# EAGLE schematic OLM-base-v.REV-I-SMT (EAGLE 6.4)
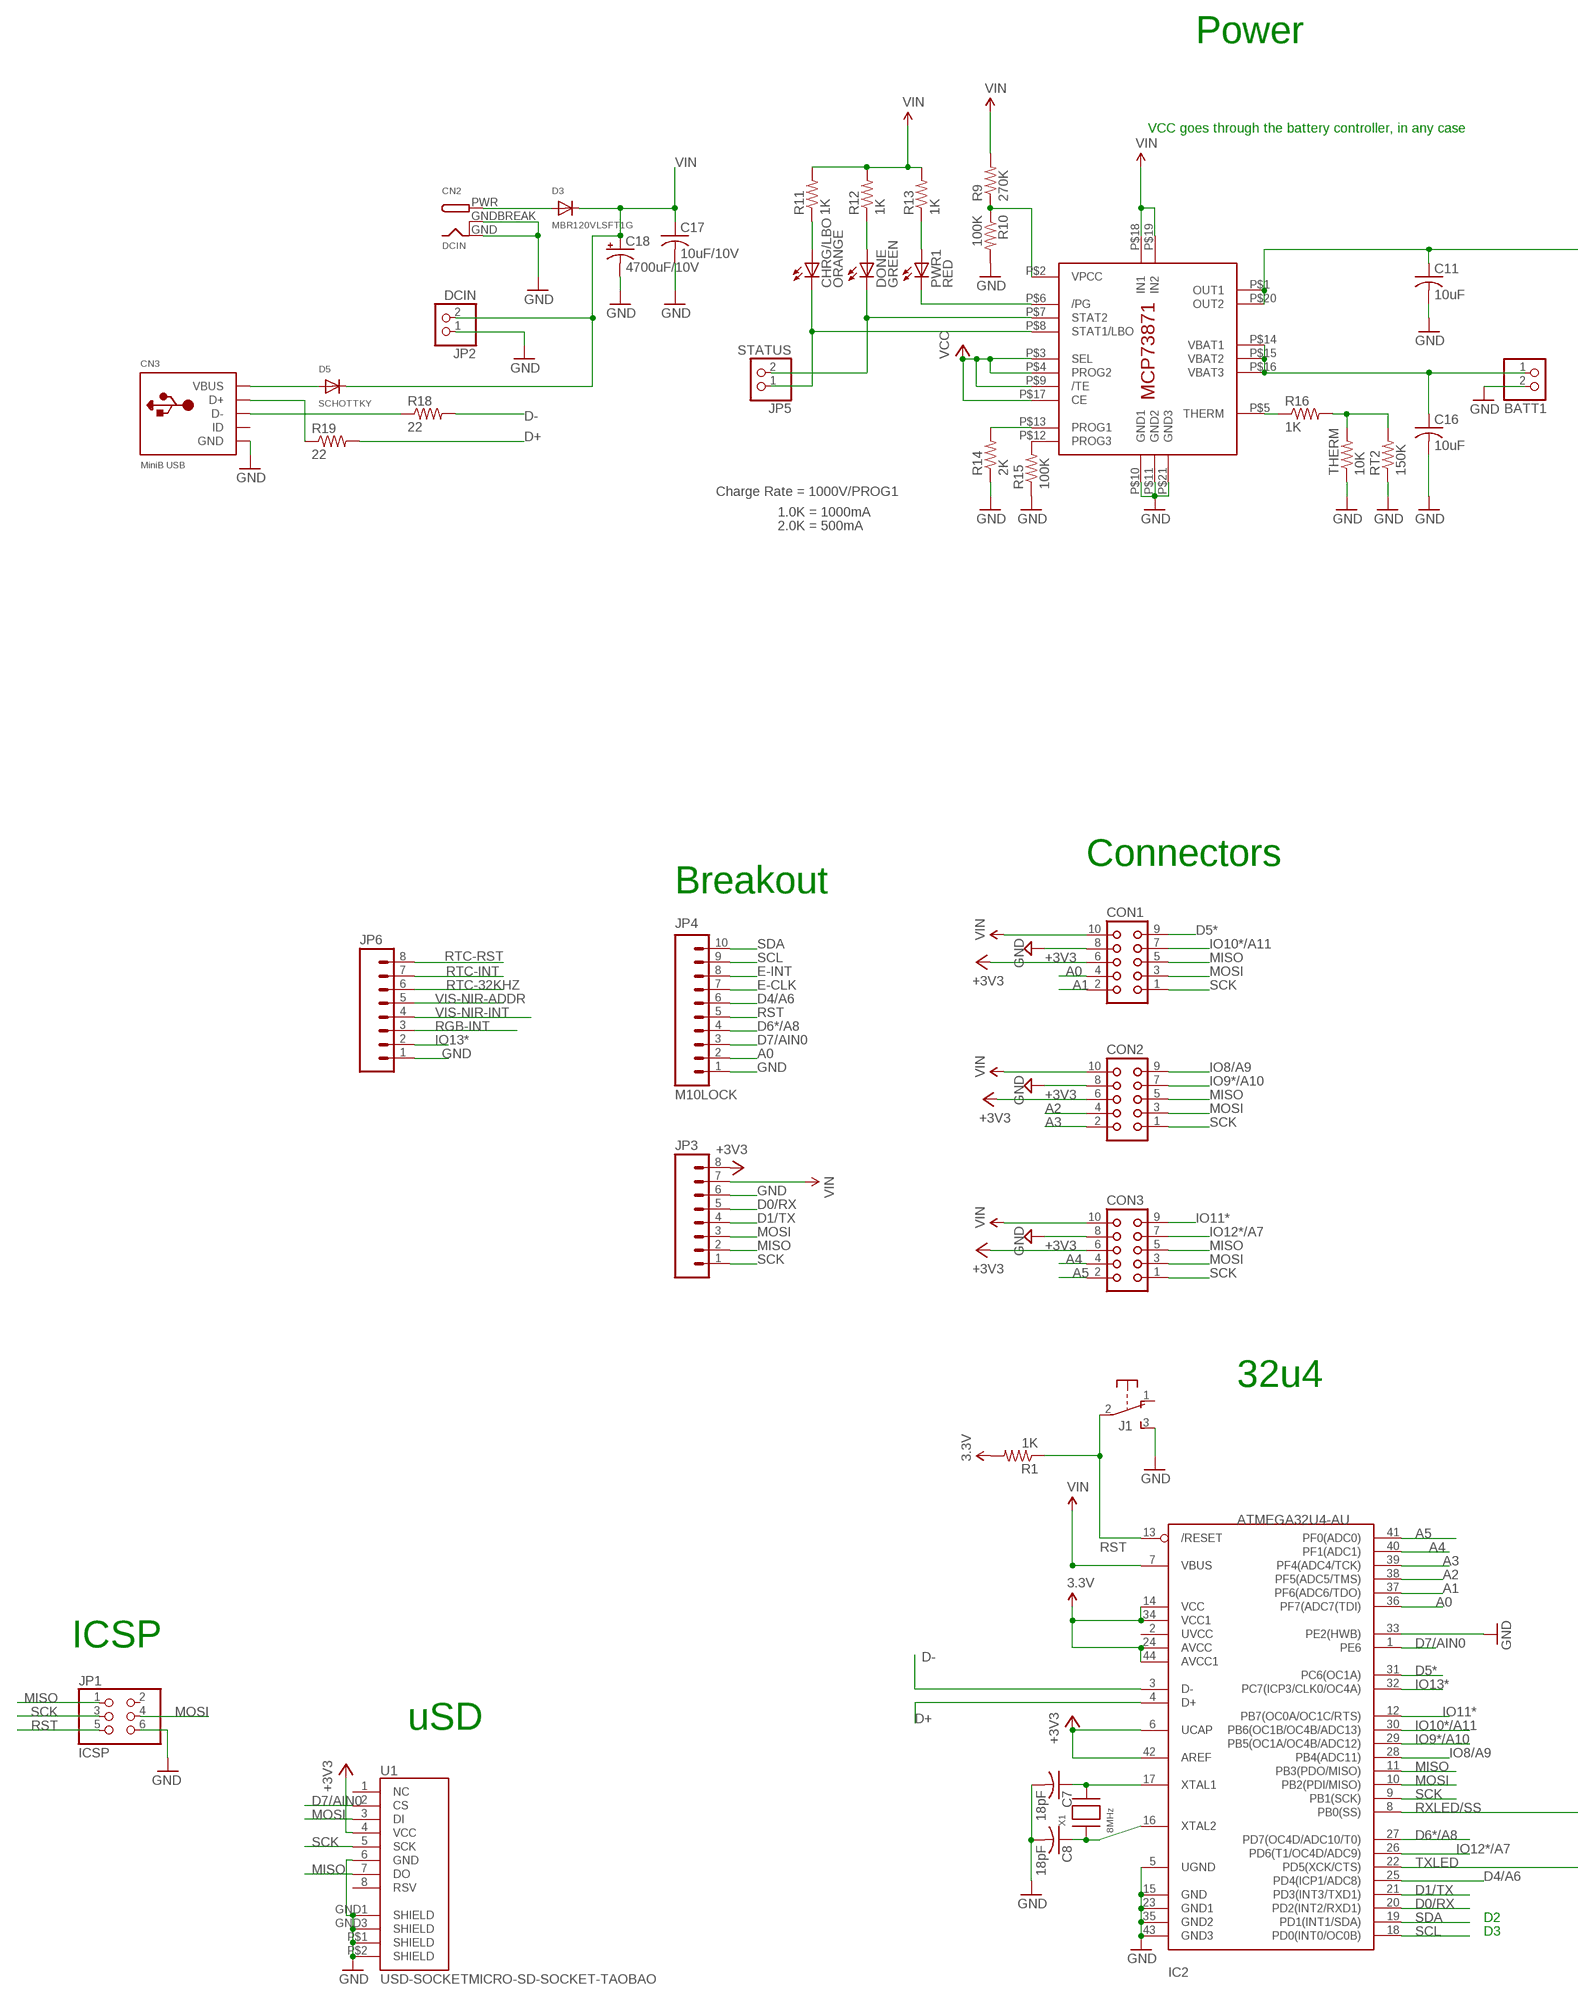
[diagram p0: schematic, sheet 1, part 1 of 3]
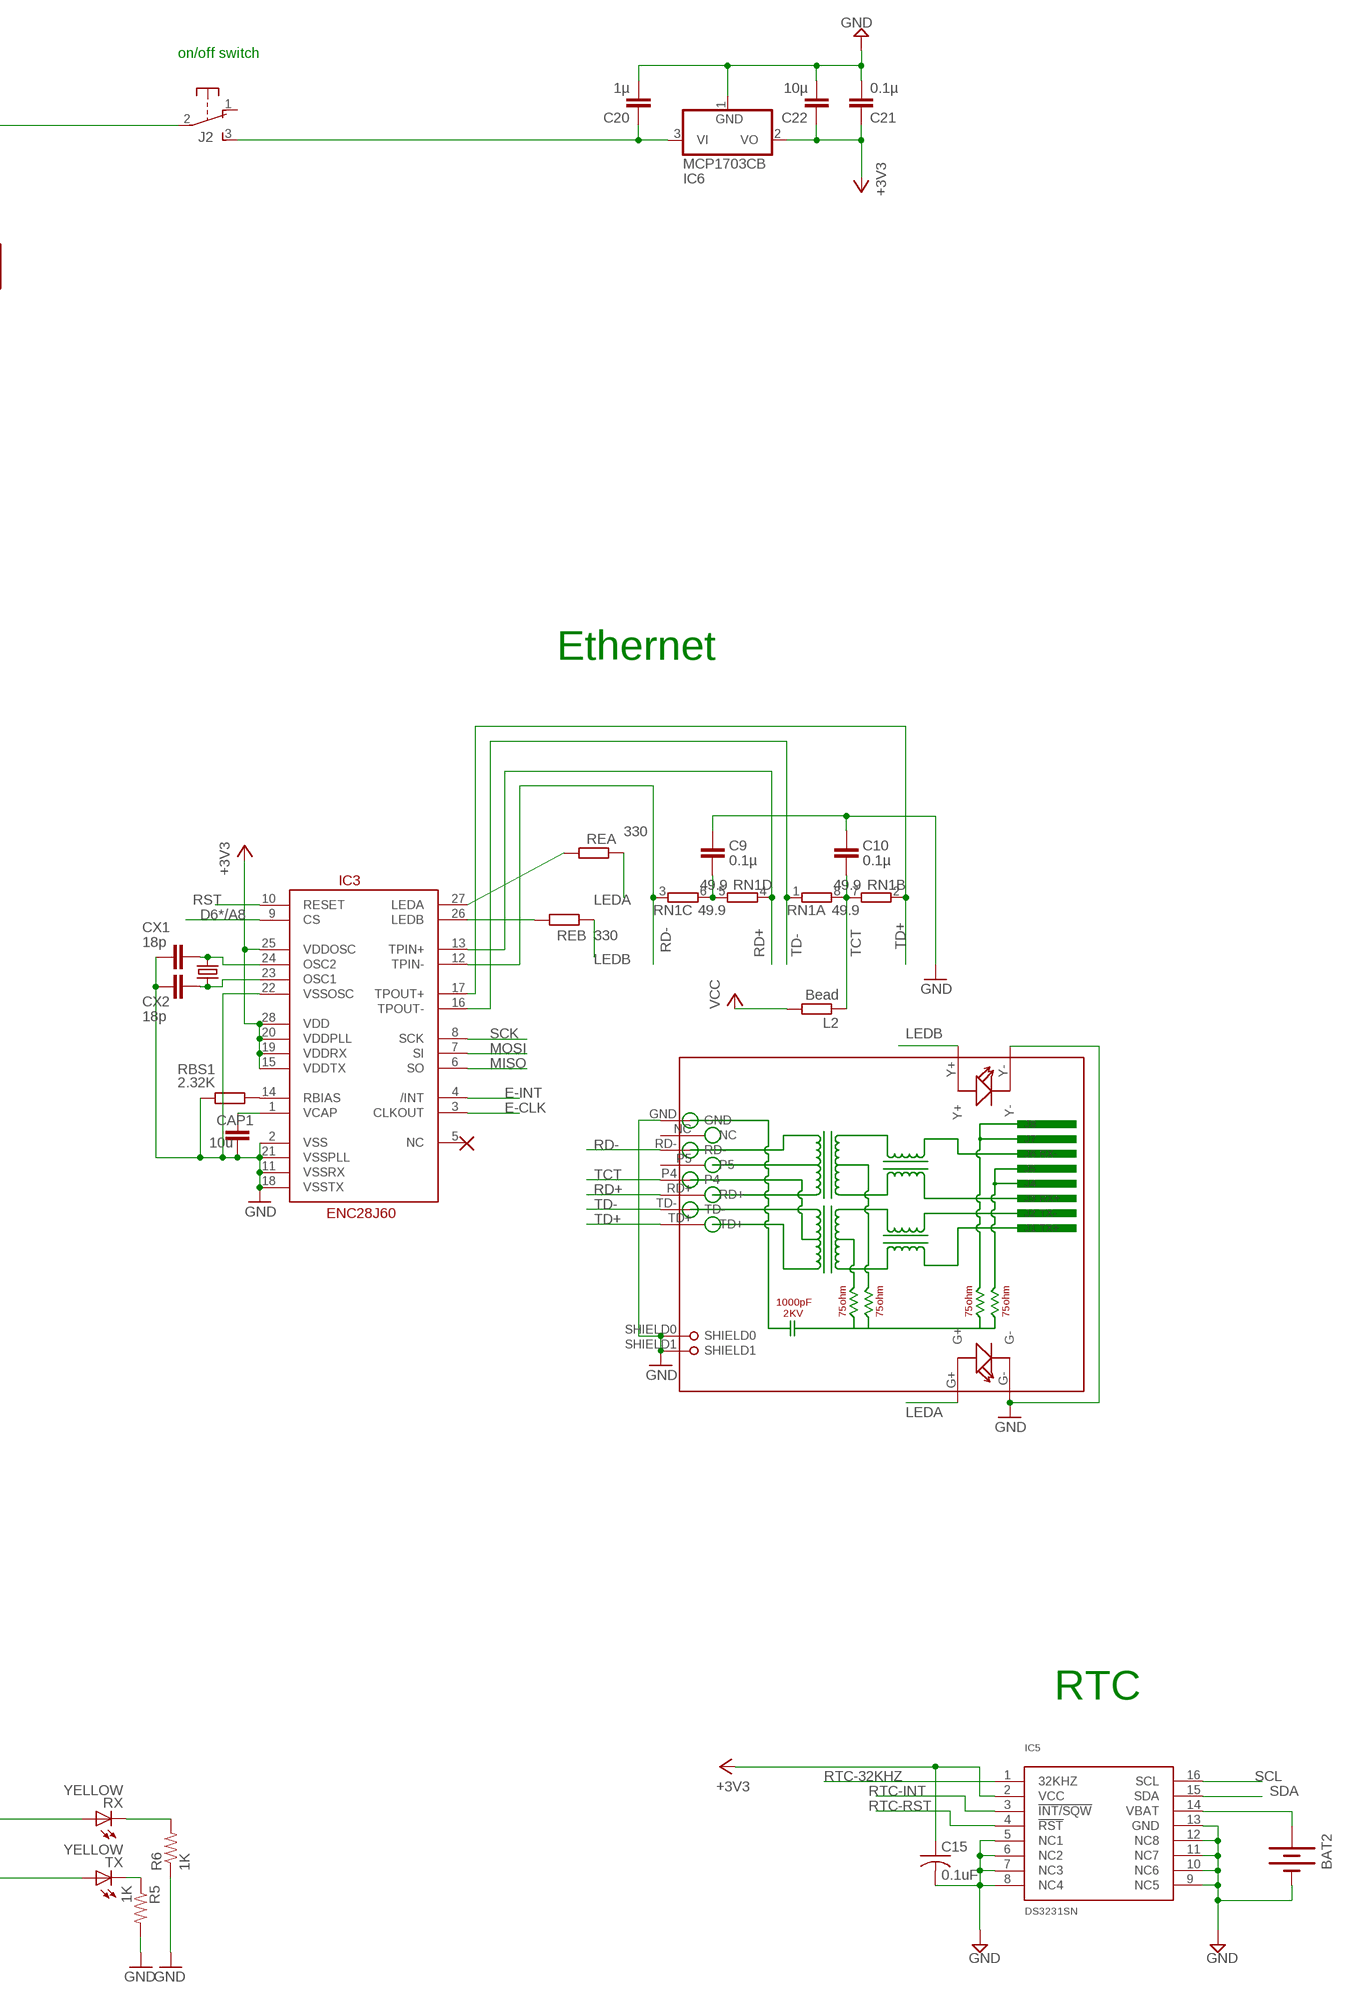
[diagram p1: schematic, sheet 1, part 2 of 3]
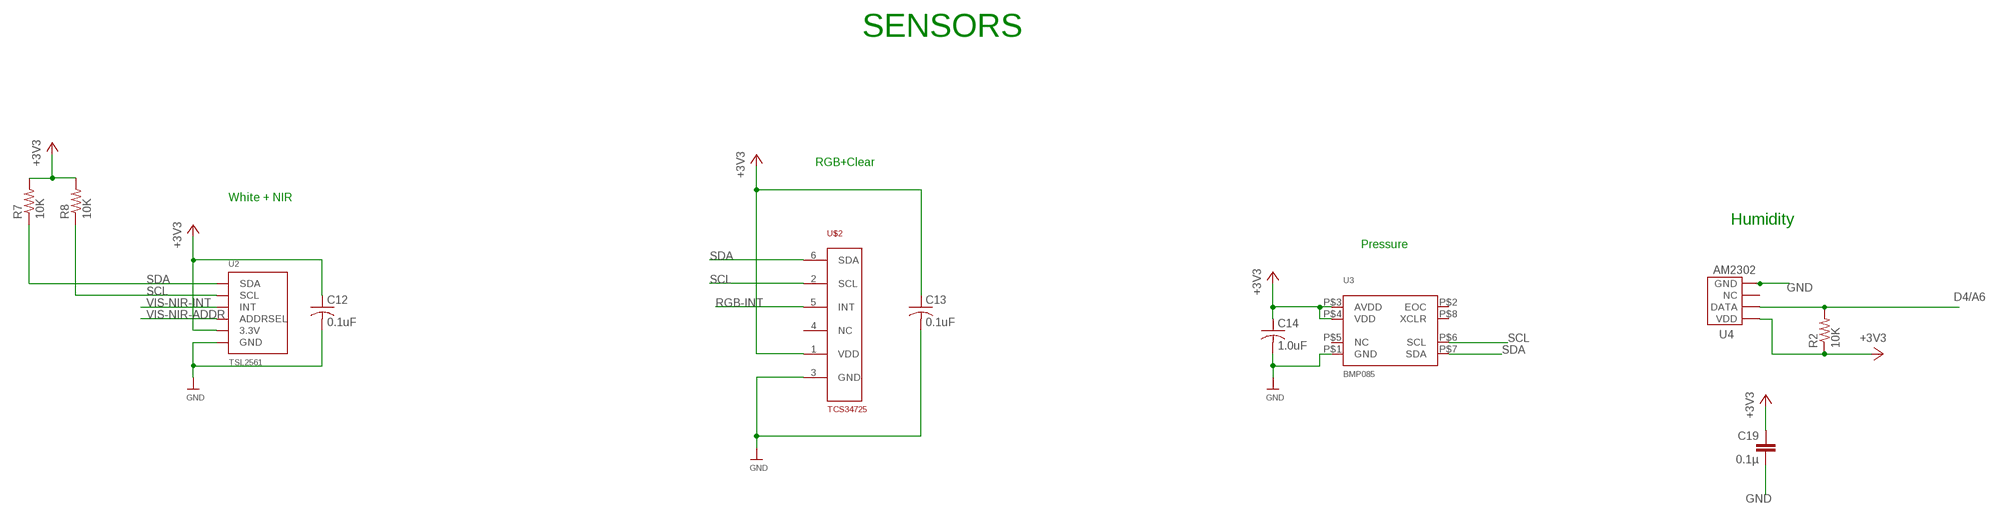
[diagram p2: schematic, sheet 1, part 3 of 3]

## Parts
BAT2  BATTERYBATTERY_12MM_SMT  [BATTCON_12MM_SMT]
BATT1  JST_2PIN-SMT-RA  [JST-PH-2-SMT-RA]
C7  18pF  C-USC0805K  [C0805K]
C8  18pF  C-USC0805K  [C0805K]
C9  0.1µ  C-EUC0805  [C0805]
C10  0.1µ  C-EUC0805  [C0805]
C11  10uF  C-USC0805K  [C0805K]
C12  0.1uF  C-USC0805  [C0805]
C13  0.1uF  C-USC0805  [C0805]
C14  1.0uF  C-USC0805  [C0805]
C15  0.1uF  C-USC0805  [C0805]
C16  10uF  C-USC0805K  [C0805K]
C17  10uF/10V  C-USC0805K  [C0805K]
C18  4700uF/10V  CPOL-USE5-13  [E5-13]
C19  0.1µ  C-EU025-024X044  [C025-024X044]
C20  1µ  C-EUC0603  [C0603]
C21  0.1µ  C-EUC0603  [C0603]
C22  10µ  CAP0603-CAP  [0603-CAP]
CAP1  10u  C-EUC0805  [C0805]
CHRG/LBO  ORANGE  LEDCHIP-LED0805  [CHIP-LED0805]
CN2  DCIN  DCBARREL1.3MM  [DCJACK_1.3MM_PTH]
CN3  MiniB USB  USBMINIBLARGE  [USB-MINIB_LARGER]
CON1  CON10L  [CON10L]
CON2  CON10L  [CON10L]
CON3  CON10L  [CON10L]
CX1  18p  C-EUC0805  [C0805]
CX2  18p  C-EUC0805  [C0805]
D3  MBR120VLSFT1G  DIODESOD-123  [SOD-123]
D5  SCHOTTKY  DIODESOD-123  [SOD-123]
DONE  GREEN  LEDCHIP-LED0805  [CHIP-LED0805]
IC2  ATMEGA32U4-AU  [TQFP44]
IC3  ENC28J60  ENC28J60SO28LONG  [SOIC28WLONG]
IC4  MCP73871  [QFN20_4MM]
IC5  DS3231SN  [SO16W]
IC6  MCP1703CB  [SOT23]
J1  EG1206  [EG1206]
J2  EG1206  [EG1206]
JP1  ICSP  PINHD-2X3  [2X03]
JP2  DCIN  HEADER-1X2  [1X02_OVAL]
JP3  M08LOCK  [1X08_LOCK]
JP4  M10LOCK  [1X10_LOCK]
JP5  STATUS  HEADER-1X2  [1X02_OVAL]
JP6  M08LOCK  [1X08_LOCK]
L2  Bead  R-EU_R0805  [R0805]
PWR1  RED  LEDCHIP-LED0805  [CHIP-LED0805]
R1  1K  R-US_R0805  [R0805]
R2  10K  R-US_R0805  [R0805]
R5  1K  R-US_R0805  [R0805]
R6  1K  R-US_R0805  [R0805]
R7  10K  R-US_R0805  [R0805]
R8  10K  R-US_R0805  [R0805]
R9  270K  R-US_R0805  [R0805]
R10  100K  R-US_R0805  [R0805]
R11  1K  R-US_R0805  [R0805]
R12  1K  R-US_R0805  [R0805]
R13  1K  R-US_R0805  [R0805]
R14  2K  R-US_FLIPFLOP  [0805-THM]
R15  100K  R-US_R0805  [R0805]
R16  1K  R-US_M0805  [M0805]
R18  22  R-US_R0805  [R0805]
R19  22  R-US_R0805  [R0805]
RBS1  2.32K  R-EU_R0805  [R0805]
REA  330  R-EU_R0805  [R0805]
REB  330  R-EU_R0805  [R0805]
RJ1  HR911105A  [HR911105A]
RN1  49.9  4R-NEXB38V  [EXB38V]
RT2  150K  R-US_M0805  [M0805]
RX  YELLOW  LEDCHIPLED_0805  [CHIPLED_0805]
THERM  10K  R-US_FLIPFLOP  [0805-THM]
TX  YELLOW  LEDCHIPLED_0805  [CHIPLED_0805]
U1  USD-SOCKETMICRO-SD-SOCKET-TAOBAO  [MICRO-SD-SOCKET-TAOBAO]
U2  TSL2561  [TSL2561_FN]
U3  BMP085  [BMP085]
U4  AM2302  [AM2302]
U$2  TCS34725  [DFN-6]
X1  8MHz  XTALNX5032  [NX5032]
X2A  25MHz  CRYSTAL10.5X4.8  [CRYSTAL-SMD-10.5X4.8-2PIN]

## Nets
+3V3: C12.1 C13.1 C14.1 C15.1 C19.1 C21.1 C22.1 CON1.6 CON2.6 CON3.6 IC2.6(UCAP) IC2.42(AREF) IC3.15(VDDTX) IC3.19(VDDRX) IC3.20(VDDPLL) IC3.25(VDDOSC) IC3.28(VDD) IC5.2(VCC) IC6.2(VO) JP3.8 R2.1 R7.2 R8.2 U1.4(VCC) U2.VDD(3.3V) U3.P$3(AVDD) U3.P$4(VDD) U4.P$1(VDD) U$2.1(VDD)
A0: CON1.4 IC2.36(PF7(ADC7(TDI)) JP4.2
A1: CON1.2 IC2.37(PF6(ADC6/TDO))
A2: CON2.4 IC2.38(PF5(ADC5/TMS))
A3: CON2.2 IC2.39(PF4(ADC4/TCK))
A4: CON3.4 IC2.40(PF1(ADC1))
A5: CON3.2 IC2.41(PF0(ADC0))
BATT: BATT1.1 C16.1 IC4.P$14(VBAT1) IC4.P$15(VBAT2) IC4.P$16(VBAT3)
D0/RX: IC2.20(PD2(INT2/RXD1)) JP3.5
D1/TX: IC2.21(PD3(INT3/TXD1)) JP3.4
D4/A6: IC2.25(PD4(ICP1/ADC8)) JP4.6 R2.2 U4.P$2(DATA)
D5*: CON1.9 IC2.31(PC6(OC1A))
D6*/A8: IC2.27(PD7(OC4D/ADC10/T0)) IC3.9(CS) JP4.4
D7/AIN0: IC2.1(PE6) JP4.3 U1.2(CS)
D+: IC2.4(D+) R19.2
D-: IC2.3(D-) R18.2
E-CLK: IC3.3(CLKOUT) JP4.7
E-INT: IC3.4(/INT) JP4.8
GND: BAT2.P$1(-) BATT1.2 C7.2 C8.2 C9.1 C10.1 C11.2 C12.2 C13.2 C14.2 C15.2 C16.2 C17.2 C18.- C19.2 C20.2 C21.2 C22.2 CAP1.2 CN2.GND CN2.GNDBREAK CN3.GND CON1.8 CON2.8 CON3.8 CX1.2 CX2.2 IC2.5(UGND) IC2.15(GND) IC2.23(GND1) IC2.33(PE2(HWB)) IC2.35(GND2) IC2.43(GND3) IC3.2(VSS) IC3.11(VSSRX) IC3.18(VSSTX) IC3.21(VSSPLL) IC3.22(VSSOSC) IC4.P$10(GND1) IC4.P$11(GND2) IC4.P$21(GND3) IC5.5(NC1) IC5.6(NC2) IC5.7(NC3) IC5.8(NC4) IC5.9(NC5) IC5.10(NC6) IC5.11(NC7) IC5.12(NC8) IC5.13(GND) IC6.1(GND) J1.3(S) JP1.6 JP2.1 JP3.6 JP4.1 JP6.1 R5.2 R6.1 R10.2 R14.1 R15.1 RBS1.1 RJ1.G- RJ1.GND RJ1.SHIELD0 RJ1.SHIELD1 RJ1.Y- RT2.1 THERM.1 U1.6(GND) U1.GND1(SHIELD) U1.GND3(SHIELD) U1.P$1(SHIELD) U1.P$2(SHIELD) U2.VSS(GND) U3.P$1(GND) U4.P$4(GND) U$2.3(GND)
IO8/A9: CON2.9 IC2.28(PB4(ADC11))
IO9*/A10: CON2.7 IC2.29(PB5(OC1A/OC4B/ADC12))
IO10*/A11: CON1.7 IC2.30(PB6(OC1B/OC4B/ADC13))
IO11*: CON3.9 IC2.12(PB7(OC0A/OC1C/RTS))
IO12*/A7: CON3.7 IC2.26(PD6(T1/OC4D/ADC9))
IO13*: IC2.32(PC7(ICP3/CLK0/OC4A)) JP6.2
LEDA: REA.2 RJ1.G+
LEDB: REB.2 RJ1.Y+
MISO: CON1.5 CON2.5 CON3.5 IC2.11(PB3(PDO/MISO)) IC3.6(SO) JP1.1 JP3.2 U1.7(DO)
MOSI: CON1.3 CON2.3 CON3.3 IC2.10(PB2(PDI/MISO)) IC3.7(SI) JP1.4 JP3.3 U1.3(DI)
N$1: BAT2.P$2(+) IC5.14(VBAT)
N$8: C7.1 IC2.17(XTAL1) X1.P$2
N$9: C8.1 IC2.16(XTAL2) X1.P$1
N$10: C9.2 RN1.5 RN1.6
N$11: R5.1 TX.C
N$12: R6.2 RX.C
N$14: IC3.27(LEDA) REA.1
N$15: IC3.26(LEDB) REB.1
N$16: CAP1.1 IC3.1(VCAP)
N$17: IC3.14(RBIAS) RBS1.2
N$18: CX1.1 IC3.24(OSC2) X2A.P$2
N$19: CX2.1 IC3.23(OSC1) X2A.P$1
N$20: IC4.P$2(VPCC) R9.1 R10.1
N$21: IC4.P$6(/PG) PWR1.C
N$23: DONE.C IC4.P$7(STAT2) JP5.2
N$29: CHRG/LBO.C IC4.P$8(STAT1/LBO) JP5.1
N$30: CHRG/LBO.A R11.1
N$31: DONE.A R12.1
N$32: PWR1.A R13.1
N$33: IC4.P$12(PROG3) R15.2
N$34: IC4.P$13(PROG1) R14.2
N$35: C11.1 IC4.P$1(OUT1) IC4.P$20(OUT2) J2.2(P)
N$36: IC4.P$5(THERM) R16.1
N$37: R16.2 RT2.2 THERM.2
N$38: CN2.PWR D3.A
N$39: CN3.VBUS D5.A
N$41: CN3.D+ R19.1
N$42: CN3.D- R18.1
N$44: C20.1 IC6.3(VI) J2.3(S)
RD+: IC3.13(TPIN+) RJ1.RD+ RN1.4
RD-: IC3.12(TPIN-) RJ1.RD- RN1.3
RGB-INT: JP6.3 U$2.5(INT)
RST: IC2.13(/RESET) J1.2(P) JP1.5 JP4.5 R1.1
RTC-32KHZ: IC5.1(32KHZ) JP6.6
RTC-INT: IC5.3(!INT/SQW) JP6.7
RTC-RST: IC5.4(!RST) JP6.8
RXLED/SS: IC2.8(PB0(SS)) RX.A
SCK: CON1.1 CON2.1 CON3.1 IC2.9(PB1(SCK)) IC3.8(SCK) JP1.3 JP3.1 U1.5(SCK)
SCL: IC2.18(PD0(INT0/OC0B)) IC5.16(SCL) JP4.9 R8.1 U2.CLK(SCL) U3.P$6(SCL) U$2.2(SCL)
SDA: IC2.19(PD1(INT1/SDA)) IC5.15(SDA) JP4.10 R7.1 U2.DATA(SDA) U3.P$7(SDA) U$2.6(SDA)
TCT: C10.2 L2.1 RJ1.P4 RN1.7 RN1.8
TD+: IC3.17(TPOUT+) RJ1.TD+ RN1.2
TD-: IC3.16(TPOUT-) RJ1.TD- RN1.1
TXLED: IC2.22(PD5(XCK/CTS)) TX.A
VCC: IC2.14(VCC) IC2.24(AVCC) IC2.34(VCC1) IC2.44(AVCC1) IC4.P$3(SEL) IC4.P$4(PROG2) IC4.P$9(/TE) IC4.P$17(CE) L2.2 R1.2 ; supply symbol labelled 3.3V
VIN: C17.1 C18.+ CON1.10 CON2.10 CON3.10 D3.C D5.C IC2.7(VBUS) IC4.P$18(IN1) IC4.P$19(IN2) JP2.2 JP3.7 R11.2 R12.2 R13.2
VIS-NIR-ADDR: JP6.5 U2.ADR(ADDRSEL)
VIS-NIR-INT: JP6.4 U2.INT
Unconnected: CN3.ID IC2.2(UVCC) IC3.5(NC) IC3.10(RESET) J1.1(O) J2.1(O) JP1.2 R9.2 RJ1.NC RJ1.P5 U1.1(NC) U1.8(RSV) U3.P$2(EOC) U3.P$5(NC) U3.P$8(XCLR) U4.P$3(NC) U$2.4(NC)

## Notes on the sheet
- Power
- VCC goes through the battery controller, in any case
- on/off switch
- Charge Rate = 1000V/PROG1
- 1.0K = 1000mA
- 2.0K = 500mA
- Ethernet
- Connectors
- Breakout
- 32u4
- ICSP
- RTC
- uSD
- D2
- D3
- SENSORS
- RGB+Clear
- White + NIR
- Humidity
- Pressure

## Library data of the parts
BAT2 = SparkFunNew:BATTERY: Battery Holders Various common sizes : AA, AAA, 20mm coin cell and 12mm coin cell.
BATT1 = adafruit:JST_2PIN: JST 2-Pin Connectors of various flavors SMT-RA (S2B-PH-SM4) 4UConnector #17311 SMT (B2B-PH-SM4) THM-RA (S2B-PH) THM (B2B-PH)
C7 C8 C11-C14 C16 C17 = adafruit:C-US: CAPACITOR, American symbol
C9 C10 C19-C21 CAP1 CX1 CX2 = resistor:C-EU: CAPACITOR, European symbol
C15 = rcl:C-US: CAPACITOR, American symbol
C18 = adafruit:CPOL-US: POLARIZED CAPACITOR, American symbol
C22 = SparkFun:CAP: Capacitor Standard 0603 ceramic capacitor, and 0.1" leaded capacitor.
CHRG/LBO DONE PWR1 RX TX = adafruit:LED: LED OSRAM: - CHIPLED LG R971, LG N971, LY N971, LG Q971, LY Q971, LO R971, LY R971 LH N974, LH R974 LS Q976, LO Q976, LY Q976 LO Q996 - Hyper CHIPLED LW Q18S LB Q993, LB Q99A, LB R99A - SideLED LS A670, LO A670, LY A670, LG A670, LP A670 LB A673, LV A673, LT A673, LW A673 LH A674 LY A675 LS A676, LA A676, LO A676, LY A676, LW A676 LS A679, LY A679, LG A679 - Hyper Micro SIDELED® LS Y876, LA Y876, LO Y876, LY Y876 LT Y87S - SmartLED LW L88C, LW L88S LB L89C, LB L89S, LG L890 LS L89K, LO L89K, LY L89K LS L896, LA L896, LO L896, LY L896 - TOPLED LS T670, LO T670, LY T670, LG T670, LP T670 LSG T670, LSP T670, LSY T670, LOP T670, LYG T670 LG T671, LOG T671, LSG T671 LB T673, LV T673, LT T673, LW T673 LH T674 LS T676, LA T676, LO T676, LY T676, LB T676, LH T676, LSB T676, LW T676 LB T67C, LV T67C, LT T67C, LS T67K, LO T67K, LY T67K, LW E67C LS E67B, LA E67B, LO E67B, LY E67B, LB E67C, LV E67C, LT E67C LW T67C LS T679, LY T679, LG T679 LS T770, LO T770, LY T770, LG T770, LP T770 LB T773, LV T773, LT T773, LW T773 LH T774 LS E675, LA E675, LY E675, LS T675 LS T776, LA T776, LO T776, LY T776, LB T776 LHGB T686 LT T68C, LB T68C - Hyper Mini TOPLED® LB M676 - Mini TOPLED Santana® LG M470 LS M47K, LO M47K, LY M47K Source: http://www.osram.convergy.de/
CN2 = microbuilder:DCBARREL: DC Barrel Jack DCJACK_1.3MM_PTH - Through Hole 1.3mm Jack (4UConnector: 05536) DCJACK_2MM_PTH - Through Hole 2.0/2.1 Jack (4UConnector: 05537) DCJACK_2MM_SMT - SMT 2.0/2.1mm Jack(4UConnector: 03267)
CN3 = microbuilder:USB: USB Connectors USBMINIB - Surface Mount Female Mini-B USB Connector 4UConnector: 06564
CON1-CON3 = con-harting:CON10L: CONNECTOR; OC_FARNELL: unknown; OC_NEWARK: unknown
D3 = microbuilder:DIODE: Diode
D5 = adafruit:DIODE: Diode
IC2 = adaprog:ATMEGA32U4
IC3 = SparkFun:ENC28J60
IC4 = adafruit:MCP73871
IC5 = comfile:DS3231SN
IC6 = linear:MCP1703: 250 mA, 16V, Low Quiescent Current LDO Regulator Source: http://ww1.microchip.com/downloads/en/DeviceDoc/22049b.pdf
J1 J2 = adafruit:EG1206
JP1 = pinhead:PINHD-2X3: PIN HEADER
JP2 JP5 = microbuilder:HEADER-1X2: PIN HEADER
JP3 JP6 = SparkFun-Connectors:M08: Header 8 Standard 8-pin 0.1" header. Use with straight break away headers (SKU : PRT-00116), right angle break away headers (PRT-00553), swiss pins (PRT-00743), machine pins (PRT-00117), and female headers (PRT-00115).
JP4 = SparkFun-Connectors:M10: Header 10 Standard 10-pin 0.1" header. Use with straight break away headers (SKU : PRT-00116), right angle break away headers (PRT-00553), swiss pins (PRT-00743), machine pins (PRT-00117), and female headers (PRT-00115).
L2 RBS1 REA REB = rcl:R-EU_: RESISTOR, European symbol
R1 R2 R5-R16 R18 R19 RT2 THERM = adafruit:R-US_: RESISTOR, American symbol
RJ1 = CONNECTER:HR911105A
RN1 = resistor-dil:4R-N: Array Chip Resistor Source: RS Component / Phycomp; OC_FARNELL: unknown; OC_NEWARK: unknown
U1 = SparkFunNew:USD-SOCKET: microSD Socket Push-push type uSD socket. Schematic element and footprint production proven. Spark Fun Electronics SKU : PRT-00127. tDoc lines correctly indicate media card edge positions when inserting (unlocked, locked, depressed).
U2 = microbuilder:TSL2561: TSL2561 Light-To-Digital Sensor Mouser Part Numbers: CS (obsolete): 856-TSL2561CS DFN (cheapest): 856-TSL2561FN
U3 = microbuilder:BMP085: BMP085 Digital Pressure Sensor 1.8-3.6V Supply, I2C Interface
U4 = sensor:AM2302
U$2 = dwbLibrary:TCS34725
X1 = adaprog:XTAL
X2A = SparkFun:CRYSTAL: Crystals Various standard crystals. Proven footprints. Spark Fun Electronics SKU : COM-00534

## Net classes
0 default: width 0.305 mm, clearance 0.203 mm
1 power: width 0.813 mm, clearance 0.203 mm